# Altium schematic sheet Servo.SchDoc
size A4
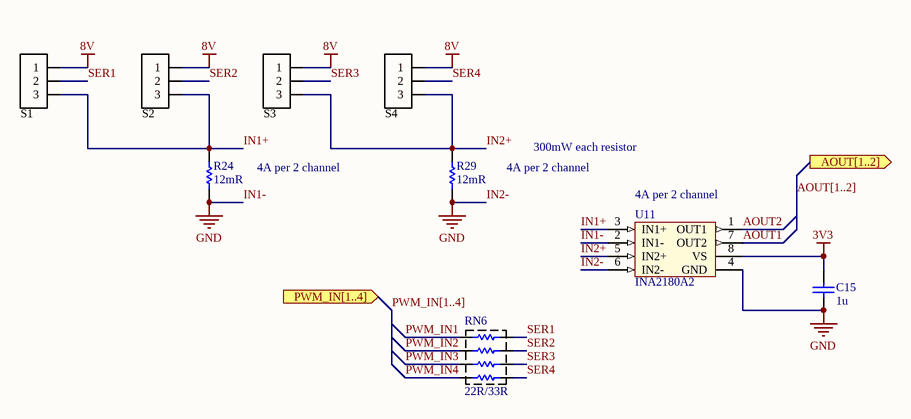
[diagram p0: Servo.SchDoc]

## Parts
C15  value 1u  [CAPC1608X90N]  (hidden comment: Cap)
R24  value 12mR  [RESC2012X70N]  (hidden comment: Res1)
R29  value 12mR  [RESC2012X70N]  (hidden comment: Res1)
RN6  value 22R/33R  [RESCAXS50P160X320X70-8N]  (hidden comment: resistor network)
S1  Header  [1x3POS_HEADER]  (value not drawn)
S2  Header  [1x3POS_HEADER]  (value not drawn)
S3  Header  [1x3POS_HEADER]  (value not drawn)
S4  Header  [1x3POS_HEADER]  (value not drawn)
U11  INA2180A2  [VSSOP8]

## Ports
AOUT[1..2] (out), PWM_IN[1..4] (in)

## Nets
3V3: C15.2 U11.8(VS)
8V: S1.1 S2.1 S3.1 S4.1
IN1-: C15.1 R24.1 R29.1 U11.2(IN1-) U11.4(GND) U11.6(IN2-)  [also labelled GND, IN2-]
AOUT1: U11.7(OUT2)
AOUT2: U11.1(OUT1)
IN1+: R24.2 S1.3 S2.3 U11.3(IN1+)
IN2+: R29.2 S3.3 S4.3 U11.5(IN2+)
PWM_IN1: RN6.1
PWM_IN2: RN6.2
PWM_IN3: RN6.3
PWM_IN4: RN6.4
SER1: RN6.8 S1.2
SER2: RN6.7 S2.2
SER3: RN6.6 S3.2
SER4: RN6.5 S4.2

## Buses and harness runs
bus AOUT[1..2] = port AOUT[1..2]
bus PWM_IN[1..4] = port PWM_IN[1..4]

## Notes on the sheet
- 4A per 2 channel
- 300mW each resistor
- (near U11) 4A per 2 channel

## Library data of the parts
C15 = Cap: Capacitor; Published: 8-Jun-2000; LatestRevisionDate: 17-Jul-2002; LatestRevisionNote: Re-released for DXP Platform.; PackageReference: RAD-0.3; Publisher: Altium Limited; PackageDescription: Radial Cap, Thru-Hole; 2 Leads; 0.3 in Pin Spacing
R24 R29 = Res1: Resistor; Published: 8-Jun-2000; LatestRevisionDate: 17-Jul-2002; LatestRevisionNote: Re-released for DXP Platform.; PackageReference: AXIAL-0.3; Publisher: Altium Limited; PackageDescription: Axial Device, Thru-Hole; 2 Leads; 0.3 in Pin Spacing
RN6 = RES_NET
S1-S4 = Header3P: Header 3-pin
U11 = INA2180A2: Dual channel current amplifier with 50V/V gain; VIN: 2.7-5.5V; ComponentLink1Description: purchase; ComponentLink1URL: https://www.mouser.com/ProductDetail/Texas-Instruments/INA2180A1IDGKR?qs=sGAEpiMZZMve4%2FbfQkoj%252BJeFFT10xS5SspuFDeMRQ2U%3D; Gain: 50V/V